# Altium project Sensor.PrjPcb
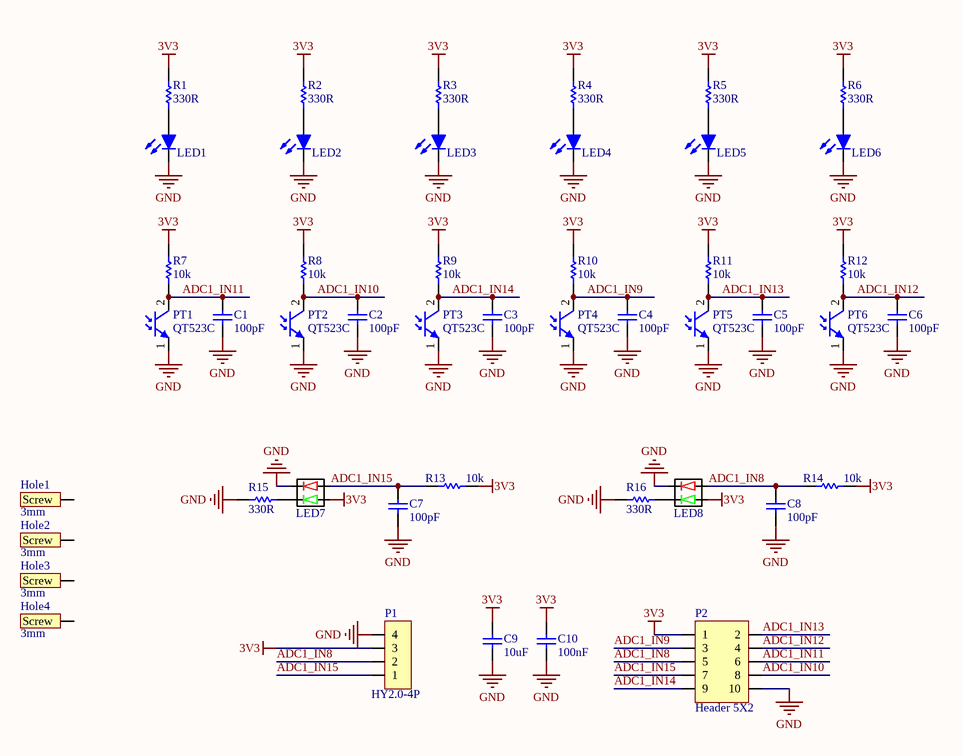
[diagram p0: Sensor.SchDoc]
1 sheet, 46 parts. Net scope: global (net labels, ports and power ports of the same name join across sheets).
Board file: Sensor.PcbDoc

## Sheet Sensor.SchDoc
size A; SheetNumber: 1; SheetTotal: 1

### Parts
C1  100pF  [C 0603 (1608)]
C2  100pF  [C 0603 (1608)]
C3  100pF  [C 0603 (1608)]
C4  100pF  [C 0603 (1608)]
C5  100pF  [C 0603 (1608)]
C6  100pF  [C 0603 (1608)]
C7  100pF  [C 0603 (1608)]
C8  100pF  [C 0603 (1608)]
C9  10uF  [C 0603 (1608)]
C10  100nF  [C 0603 (1608)]
Hole1  3mm  [SCREW/3M/7M]
Hole2  3mm  [SCREW/3M/7M]
Hole3  3mm  [SCREW/3M/7M]
Hole4  3mm  [SCREW/3M/7M]
LED1  Led-Red  [LED 5MM]  (value not drawn)
LED2  Led-Red  [LED 5MM]  (value not drawn)
LED3  Led-Red  [LED 5MM]  (value not drawn)
LED4  Led-Red  [LED 5MM]  (value not drawn)
LED5  Led-Red  [LED 5MM]  (value not drawn)
LED6  Led-Red  [LED 5MM]  (value not drawn)
LED7  LED F2/3MM 90  [LED 2x3MM 90]  (value not drawn)
LED8  LED F2/3MM 90  [LED 2x3MM 90]  (value not drawn)
P1  HY2.0-4P  [HY2.0-4P-RA]
P2  Header 5X2  [DC3-10P-1.27MM]
PT1  QT523C  [QT523C 5800B]
PT2  QT523C  [QT523C 5800B]
PT3  QT523C  [QT523C 5800B]
PT4  QT523C  [QT523C 5800B]
PT5  QT523C  [QT523C 5800B]
PT6  QT523C  [QT523C 5800B]
R1  330R  [R 0603 (1608)]
R2  330R  [R 0603 (1608)]
R3  330R  [R 0603 (1608)]
R4  330R  [R 0603 (1608)]
R5  330R  [R 0603 (1608)]
R6  330R  [R 0603 (1608)]
R7  10k  [R 0603 (1608)]
R8  10k  [R 0603 (1608)]
R9  10k  [R 0603 (1608)]
R10  10k  [R 0603 (1608)]
R11  10k  [R 0603 (1608)]
R12  10k  [R 0603 (1608)]
R13  10k  [R 0603 (1608)]
R14  10k  [R 0603 (1608)]
R15  330R  [R 0603 (1608)]
R16  330R  [R 0603 (1608)]

### Nets
3V3: C9.1 C10.1 LED7.3(A) LED8.3(A) P1.3 P2.1 R1.2 R2.2 R3.2 R4.2 R5.2 R6.2 R7.2 R8.2 R9.2 R10.2 R11.2 R12.2 R13.1 R14.1
GND: C1.2 C2.2 C3.2 C4.2 C5.2 C6.2 C7.2 C8.2 C9.2 C10.2 LED1.2(K) LED2.2(K) LED3.2(K) LED4.2(K) LED5.2(K) LED6.2(K) LED7.2(K) LED8.2(K) P1.4 P2.10 PT1.1(E) PT2.1(E) PT3.1(E) PT4.1(E) PT5.1(E) PT6.1(E) R15.2 R16.2
ADC1_IN8: C8.1 LED8.1(A) P1.2 P2.5 R14.2
ADC1_IN9: C4.1 P2.3 PT4.2(C) R10.1
ADC1_IN10: C2.1 P2.8 PT2.2(C) R8.1
ADC1_IN11: C1.1 P2.6 PT1.2(C) R7.1
ADC1_IN12: C6.1 P2.4 PT6.2(C) R12.1
ADC1_IN13: C5.1 P2.2 PT5.2(C) R11.1
ADC1_IN14: C3.1 P2.9 PT3.2(C) R9.1
ADC1_IN15: C7.1 LED7.1(A) P1.1 P2.7 R13.2
NetLED1_1: LED1.1(A) R1.1
NetLED2_1: LED2.1(A) R2.1
NetLED3_1: LED3.1(A) R3.1
NetLED4_1: LED4.1(A) R4.1
NetLED5_1: LED5.1(A) R5.1
NetLED6_1: LED6.1(A) R6.1
NetLED7_4: LED7.4(K) R15.1
NetLED8_4: LED8.4(K) R16.1

Not connected (* = marked no-connect by the designer): Hole1 1(Screw); Hole2 1(Screw); Hole3 1(Screw); Hole4 1(Screw)

### Library data of the parts
C1-C10 = Capacitor NP: Capacitor non-pol
Hole1-Hole4 = Screw
LED1-LED6 = Led: Typical LED
LED7 LED8 = LED F2/3MM 90: Typical LED
P1 = Header 4: Header, 4-Pin
P2 = Header 5X2: Header, 5-Pin, Dual row; LatestRevisionDate: 17-Jul-2002; LatestRevisionNote: Re-released for DXP Platform.; Publisher: Altium Limited
PT1-PT6 = QT523C: PHOTODIODE 5800B
R1-R16 = Resistor: Published: 8-Jun-2000; LatestRevisionDate: 17-Jul-2002; LatestRevisionNote: Re-released for DXP Platform.; PackageReference: AXIAL-0.3; Publisher: Altium Limited